# EAGLE design version1 (EAGLE 8.7.1)
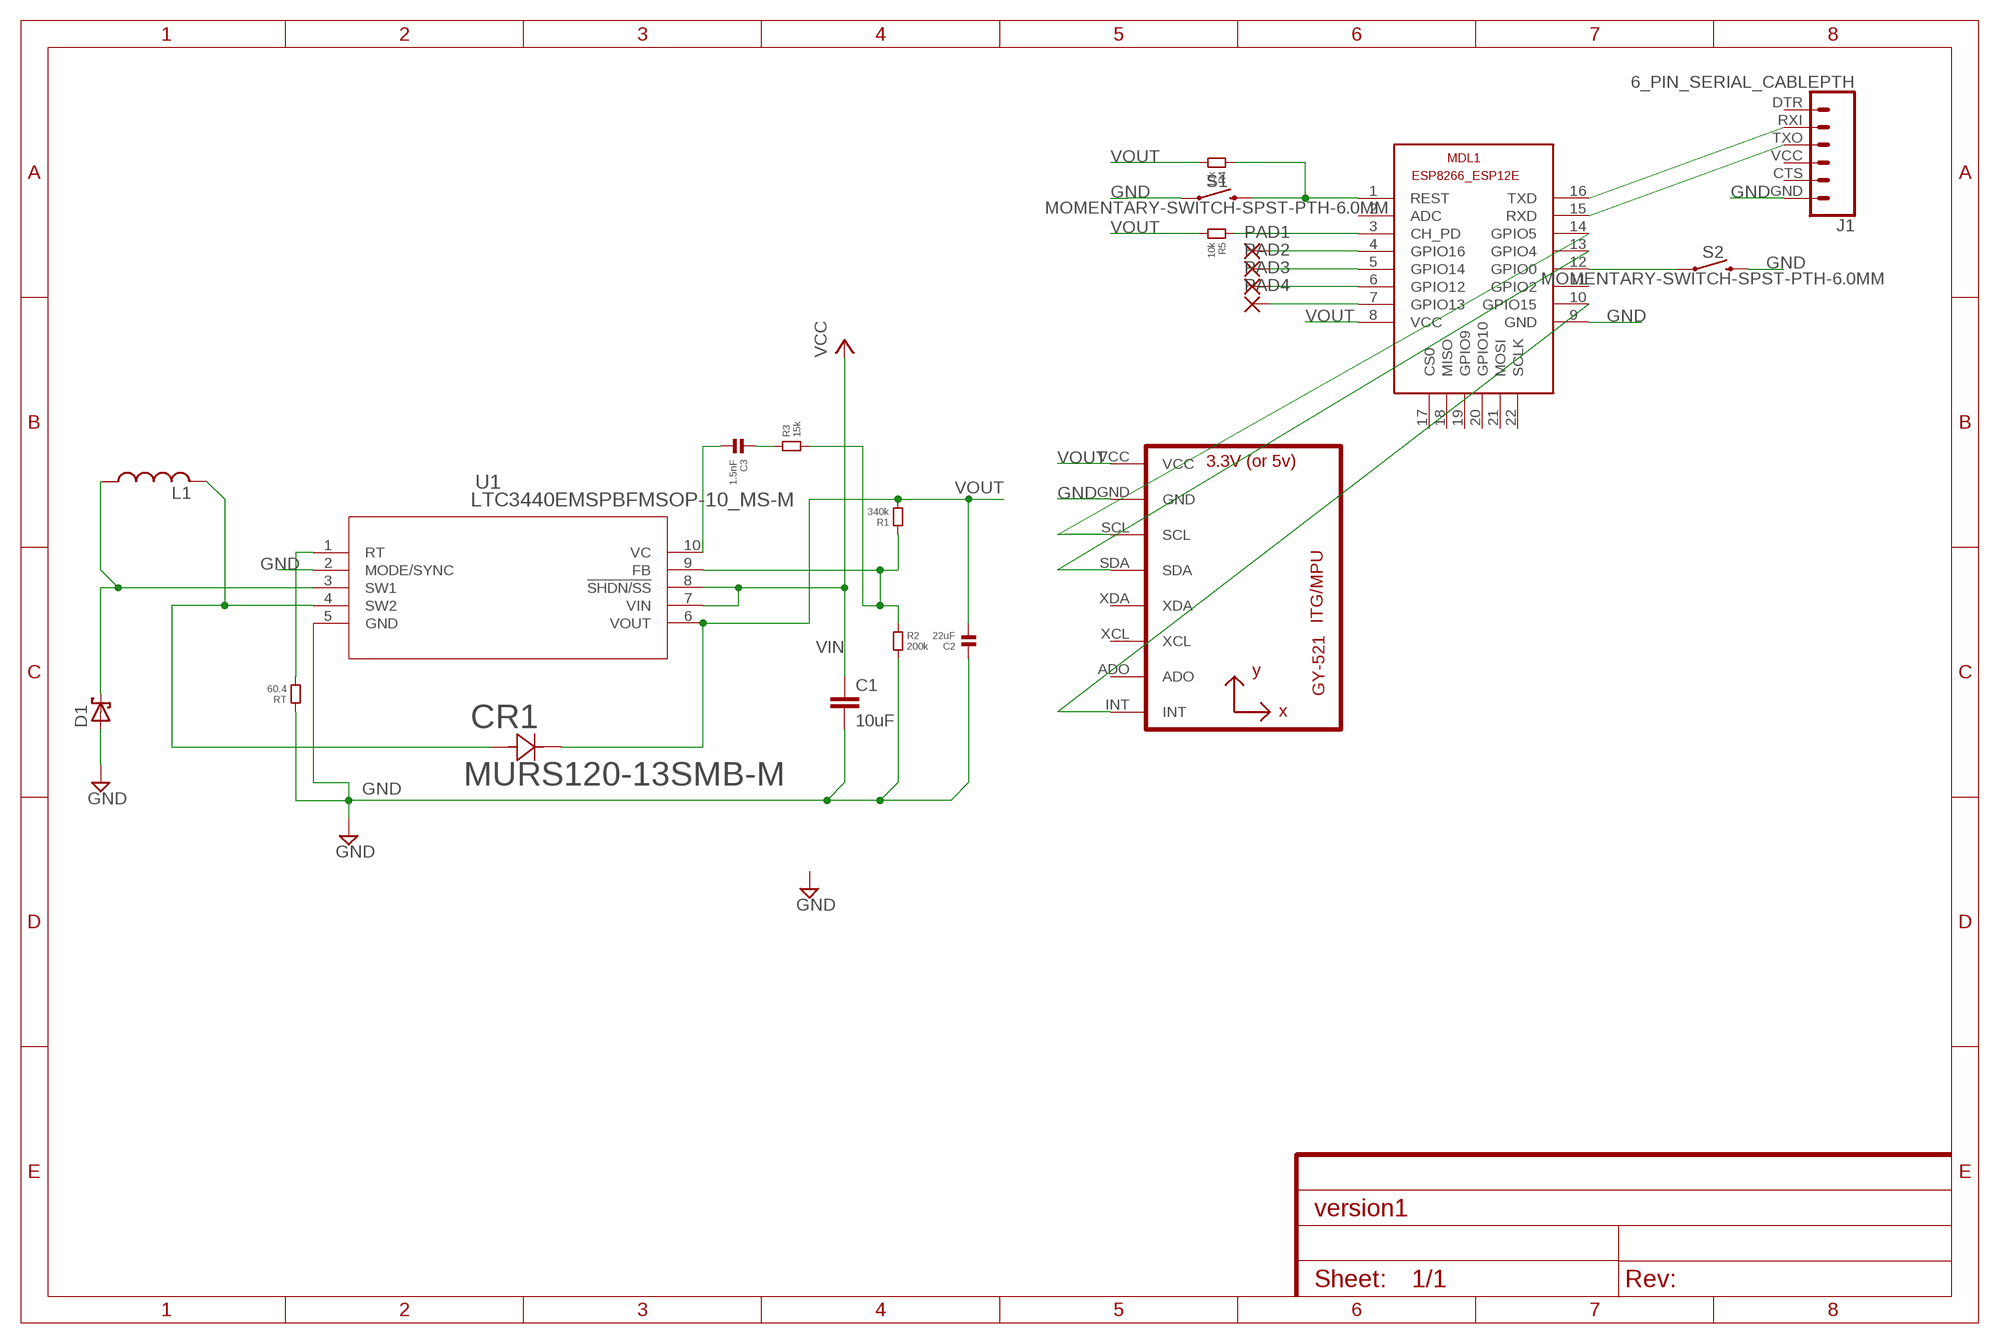
[diagram p0: schematic, sheet 1]

## Parts
C1  10uF  10UF-1206-6.3V-20%  [1206]
C2  22uF  CAPACITOR.1206  [1206]
C3  1.5nF  CAPACITOR.1206  [1206]
CR1  MURS120-13SMB-M  [SMB-M]
D1  SCHOTTKY-DIODEDFLS130L-7  [POWERDI-123]
J1  6_PIN_SERIAL_CABLEPTH  [FTDI_BASIC]
L1  INDUCTOR-SUMIDA-CDRH4D18  [INDUCTOR-SUMIDA-CDRH4D18]
MDL1  ESP8266-12EESP8266-ESP12E  [ESP8266-ESP12E]
PAD1  1,6/0,9  [1,6/0,9]
PAD2  1,6/0,9  [1,6/0,9]
PAD3  1,6/0,9  [1,6/0,9]
PAD4  1,6/0,9  [1,6/0,9]
R1  340k  RESISTOR.1206  [1206]
R2  200k  RESISTOR.1206  [1206]
R3  15k  RESISTOR.1206  [1206]
R4  10k  RESISTOR.1206  [1206]
R5  10k  RESISTOR.1206  [1206]
RT  60.4  RESISTOR.1206  [1206]
S1  MOMENTARY-SWITCH-SPST-PTH-6.0MM  [TACTILE_SWITCH_PTH_6.0MM]
S2  MOMENTARY-SWITCH-SPST-PTH-6.0MM  [TACTILE_SWITCH_PTH_6.0MM]
U1  LTC3440EMSPBFMSOP-10_MS-M  [MSOP-10_MS-M]
U2  GY-521MPU6050  [GY-521]

## Nets
GND: C1.2 C2.1 D1.A J1.GND MDL1.9(GND) R2.2 RT.1 S1.1 S2.3 U1.2(MODE/SYNC) U1.5(GND) U2.GND
N$1: D1.C L1.P$1 U1.3(SW1)
N$2: CR1.2 L1.P$2 U1.4(SW2)
N$3: C3.2 U1.10(VC)
N$4: RT.2 U1.1(RT)
N$5: C3.1 R3.1
N$6: R1.1 R2.1 R3.2 U1.9(FB)
N$7: MDL1.12(GPIO0) S2.1
N$8: MDL1.1(REST) R4.1 S1.3
N$9: J1.RXI MDL1.16(TXD)
N$10: MDL1.3(CH_PD) R5.1
N$11: MDL1.14(GPIO5) U2.SCL
N$12: MDL1.13(GPIO4) U2.SDA
N$13: MDL1.10(GPIO15) U2.INT
N$14: J1.TXO MDL1.15(RXD)
N$16: MDL1.4(GPIO16) PAD1.1(P)
N$17: MDL1.5(GPIO14) PAD2.1(P)
N$18: MDL1.6(GPIO12) PAD3.1(P)
N$19: MDL1.7(GPIO13) PAD4.1(P)
VIN: C1.1 U1.7(VIN) U1.8(!SHDN/SS) ; supply symbol labelled VCC
VOUT: C2.2 CR1.1 MDL1.8(VCC) R1.2 R4.2 R5.2 U1.6(VOUT) U2.VCC
Unconnected: J1.CTS J1.DTR J1.VCC MDL1.2(ADC) MDL1.11(GPIO2) MDL1.17(CS0) MDL1.18(MISO) MDL1.19(GPIO9) MDL1.20(GPIO10) MDL1.21(MOSI) MDL1.22(SCLK) U2.ADO U2.XCL U2.XDA

## Library data of the parts
C1 = SparkFun-Capacitors:10UF: 10.0µF ceramic capacitors A capacitor is a passive two-terminal electrical component used to store electrical energy temporarily in an electric field.; PROD_ID: CAP-10057
C2 C3 = ECE362:CAPACITOR
CR1 = ECE362:MURS120-13; MANUFACTURER_PART_NUMBER: MURS12013; VENDOR: Diodes Inc
D1 = ECE362:SCHOTTKY-DIODE: Schottky Diode; MF: Diodes Inc; MOUSER: 621-DFLS130L; MPN: DFLS130L-7
J1 = SparkFun-Connectors:6_PIN_SERIAL_CABLE: 6-pin header connection for use with the "FTDI BASIC" pinout - CABLE SIDE. Also known as "Arduino Serial Program Header". This is used on a design to provide a 6-pin connection point for serial communication usually from a USB cable (D+/D-) to these headers (RX/TX). It also has the remaining pins necessary for programming in the Arduino evironment (DTR, GND, and sometimes VCC). Note, this device has "CABLE" in the name. It is intended to be used on a design that usually lives on the end of your USB cable and prvides the converter chip (FTDI232 or FTDI231x) to commnicate serial RX/TX. The "sister" device, named "TARGET" is inteneded to be used on a design that contains a target micro-controller that you wish to program. You can populate with some of these: Female Headers <https://www.sparkfun.com/products/115> (PRT-00115) For reference (or to suit your programming needs) check out these designs: SparkFun FTDI Basic Breakout - 5V <https://www.sparkfun.com/products/9716> (DEV-09716) SparkFun FTDI Basic Breakout - 3.3V <https://www.sparkfun.com/products/9873> (DEV-09873) SparkFun FTDI SmartBasic <https://www.sparkfun.com/products/12935> (DEV-12935) SparkFun Beefy 3 - FTDI Basic Breakout <https://www.sparkfun.com/products/13746> (DEV-13746)
L1 = ECE362:INDUCTOR-SUMIDA-CDRH4D18
MDL1 = ESP8266-ESP12E:ESP8266-12E: ESP8266-12E with additional I/O and GPIO04/05 corrected The author cannot warrant that this library is free from error or will meet your specific requirements. Created by PuceBaboon.com. Komagane, Nagano, JAPAN
PAD1-PAD4 = wirepad:1,6/0,9: THROUGH-HOLE PAD
R1-R5 RT = ECE362:RESISTOR
S1 S2 = SparkFun-Switches:MOMENTARY-SWITCH-SPST: Momentary Switch (Pushbutton) - SPST Normally-open (NO) SPST momentary switches (buttons, pushbuttons). Variants PTH-12MM - 12mm square, through-hole Momentary Pushbutton Switch - 12mm Square <https://www.sparkfun.com/products/9190> (COM-09190) PTH-6.0MM, PTH-6.0MM-KIT - 6.0mm square, through-hole Mini Pushbutton Switch <https://www.sparkfun.com/products/97> (COM-00097) KIT package intended for soldering kit's - only one side of pads' copper is exposed. PTH-RIGHT-ANGLE-KIT - Right-angle, through-hole Right Angle Tactile Button <https://www.sparkfun.com/products/10791> - Used on SparkFun BigTime Watch Kit <https://www.sparkfun.com/products/11734> SMD-12MM - 12mm square, surface-mount Tactile Button - SMD (12mm) <https://www.sparkfun.com/products/12993> (COM-12993) Used on SparkFun PicoBoard <https://www.sparkfun.com/products/11888> SMD-4.5MM - 4.5mm Square Trackball Switch Used on SparkFun Blackberry Trackballer Breakout <https://www.sparkfun.com/products/13169> SMD-4.6MMX2.8MM - 4.60mm x 2.80mm, surface mount Used on SparkFun SAMD21 Mini Breakout <https://www.sparkfun.com/products/13664> SMD-5.2MM, SMD-5.2-REDUNDANT - 5.2mm square, surface-mount Mini Pushbutton Switch - SMD <https://www.sparkfun.com/products/8720> (COM-08720) Used on Arduino Pro Mini <https://www.sparkfun.com/products/11114> REDUNDANT package connects both switch circuits together SMD-6.0X3.5MM - 6.0 x 3.5mm, surface mount Momentary Reset Switch SMD <https://www.sparkfun.com/products/8229> (COM-08229) SMD-6.2MM-TALL - 6.2mm square, surface mount Tactile Button - SMD (6mm) <https://www.sparkfun.com/products/12992> Used on SparkFun Digital Sandbox <https://www.sparkfun.com/products/12651> SMD-RIGHT-ANGLE - Right-angle, surface mount Used on SparkFun Block for Intel® Edison - Arduino <https://www.sparkfun.com/products/13036>; PROD_ID: SWCH-08441; SF_SKU: COM-00097
U1 = LTC3440:LTC3440EMSPBF; MANUFACTURER_PART_NUMBER: LTC3440EMS#PBF; VENDOR: Linear Technology
U2 = ECE362:GY-521

## Board
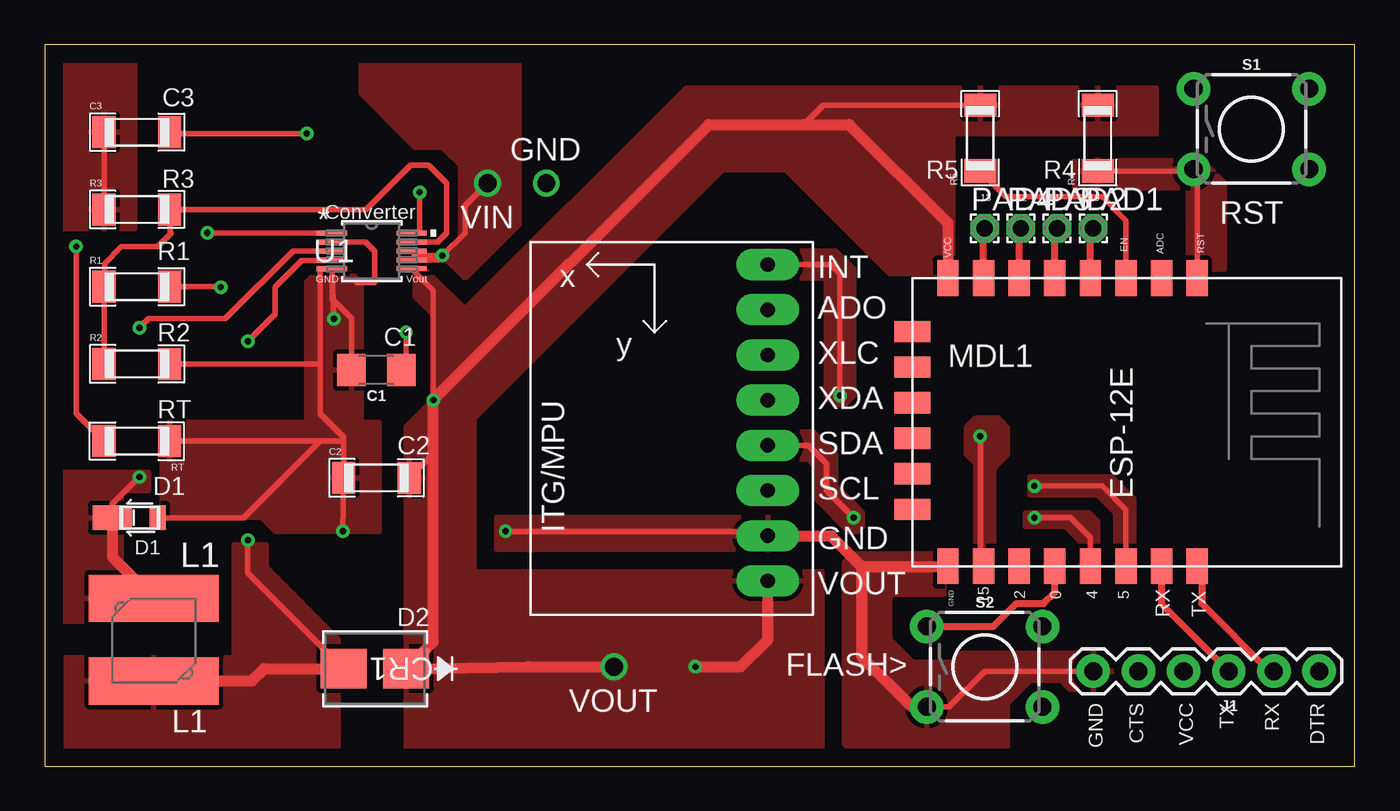
[diagram p1: board, top side]
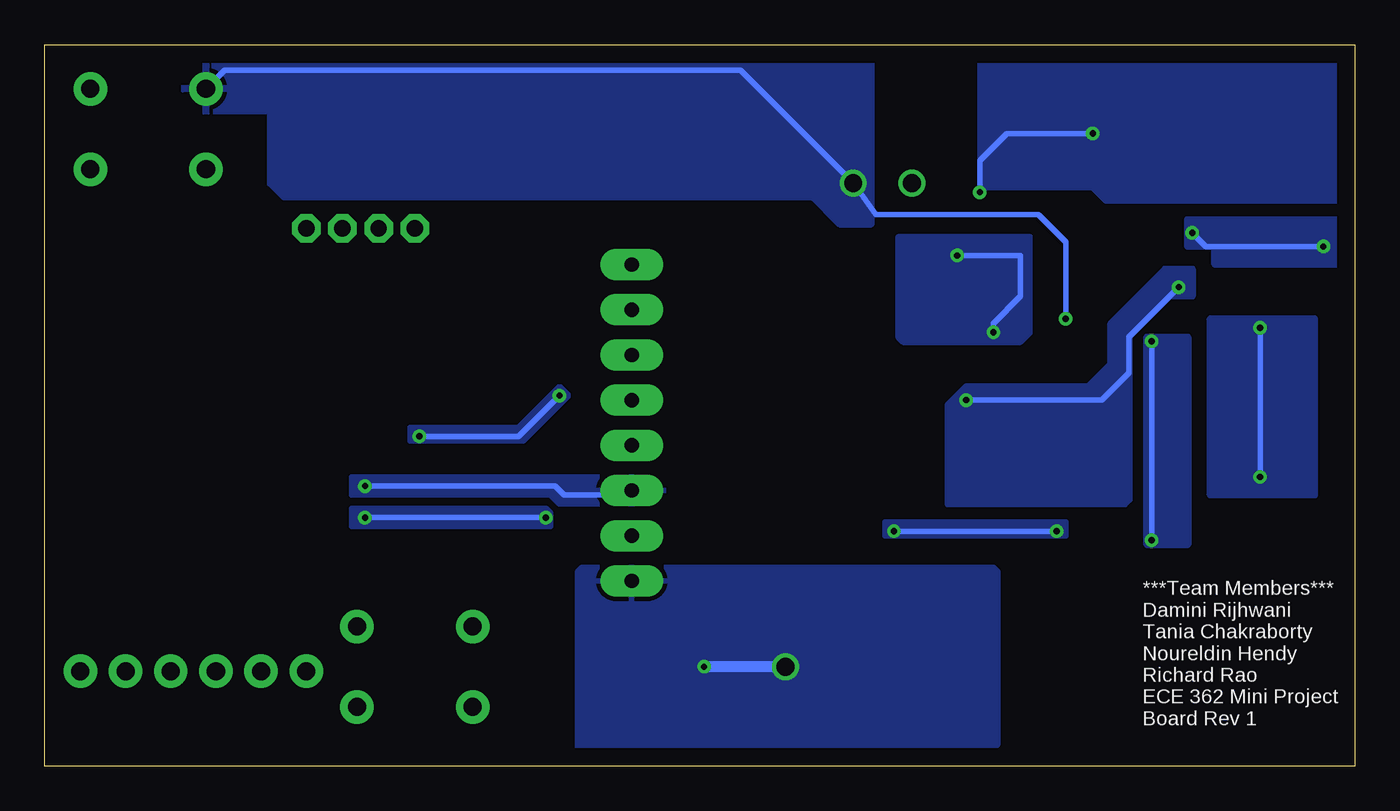
[diagram p2: board, bottom side, seen from below]

Size 73.64 x 40.56 mm. Coordinates in mm from the lower left corner, seen from the top.
Outline: 0,0 73.64,0 73.64,40.56 0,40.56 0,0
Copper layers (1*16): Top 0.035mm / dielectric 1.5mm / Bottom 0.035mm
Design rules "default": minimum track width 6mil, minimum drill 0.35mm, track to track 6mil, track to pad 6mil, pad to pad 6mil, via to via 6mil, smd to smd 6mil, copper to edge 40mil, drill to drill 6mil, minimum pad ring 10mil, minimum via ring 8mil, stop-mask expansion 4mil, vias tented up to drill 0mil, thermal gap 10mil

### Footprints (pad centres in the part's own frame; a part is rotated, then mirrored left to right if it is on the bottom)
1206 = smd 1.6 x 1.8: 1 -1.4,0; 2 1.4,0
1206' = smd 1.3 x 1.8: 1 -1.85,0; 2 1.85,0
SMB-M = smd 2.587 x 2.21: 1 -1.756,0; 2 1.756,0
POWERDI-123 = smd 0.9 x 1.4: A -1.6,0 | smd 2.2 x 1.4: C 0.95,0
FTDI_BASIC = drill 1.016 pad 1.88: CTS 10.16,0; DTR 0,0; GND 12.7,0; RXI 2.54,0; TXO 5.08,0; VCC 7.62,0
INDUCTOR-SUMIDA-CDRH4D18 = smd 7.3 x 2.65: P$1 0,-2.325; P$2 0,2.325
ESP8266-ESP12E = smd 2 x 1.2: 1 -7.62,5.84; 2 -7.62,3.84; 3 -7.62,1.84; 4 -7.62,-0.16; 5 -7.62,-2.16; 6 -7.62,-4.16; 7 -7.62,-6.16; 8 -7.62,-8.16; 9 8.58,-8.16; 10 8.58,-6.16; 11 8.58,-4.16; 12 8.58,-2.16; 13 8.58,-0.16; 14 8.58,1.84; 15 8.58,3.84; 16 8.58,5.84 | smd 1.2 x 2: 17 -4.62,-10.16; 18 -2.62,-10.16; 19 -0.62,-10.16; 20 1.38,-10.16; 21 3.38,-10.16; 22 5.38,-10.16
1,6/0,9 = drill 0.914 pad 1.6 octagon: 1 0,0
TACTILE_SWITCH_PTH_6.0MM = drill 1.016 pad 1.88: 1 -3.251,2.261; 2 3.251,2.261; 3 -3.251,-2.261; 4 3.251,-2.261
MSOP-10_MS-M = smd 1.702 x 0.279: 1 -2.235,1.001; 2 -2.235,0.5; 3 -2.235,0; 4 -2.235,-0.5; 5 -2.235,-1.001; 6 2.235,-1.001; 7 2.235,-0.5; 8 2.235,0; 9 2.235,0.5; 10 2.235,1.001
GY-521 = drill 0.8 pad 1.778 long: ADO -8.89,-6.35; GND -8.89,6.35; INT -8.89,-8.89; SCL -8.89,3.81; SDA -8.89,1.27; VCC -8.89,8.89; XCL -8.89,-3.81; XDA -8.89,-1.27

### Placement (x,y rotation side)
C1  18.65,22.25 180 top
C2  22uF  [1206']  18.65,16.21 0 top
C3  1.5nF  [1206']  5.19,35.63 0 top
CR1  18.57,5.48 180 top
D1  4.76,13.97 180 top
J1  71.63,5.33 180 top
L1  6.14,7.11 180 top
MDL1  58.93,19.81 270 top
PAD1  58.93,30.23 0 top
PAD2  56.9,30.23 0 top
PAD3  54.86,30.23 0 top
PAD4  52.83,30.23 0 top
R1  340k  [1206']  5.19,26.95 0 top
R2  200k  [1206']  5.19,22.61 0 top
R3  15k  [1206']  5.19,31.29 0 top
R4  10k  [1206']  59.18,35.31 90 top
R5  10k  [1206']  52.58,35.31 90 top
RT  60.4  [1206']  5.19,18.27 180 top
S1  67.82,35.81 0 top
S2  52.83,5.59 0 top
U1  18.39,28.96 0 top
U2  31.75,19.3 180 top

### Tracks (layer width: path | path; a pad name or v marks a point on that pad's centre or on a via)
GND  (via drill 0.35, 1)
  Top 0.305: C1.2 17.25,25.17 16.15,26.26 U1.5 | 16.8,18.29 C2.1 v16.76,13.21 | 16.8,18.29 16.8,18.51 15.49,19.81 15.49,22.61 | 15.49,22.61 15.49,27.94 16.14,27.94 U1.5 | R2.2 15.49,22.61 | RT.1 15.49,18.27 | 15.49,18.27 16.78,18.27 16.8,18.29 | D1.A 11.19,13.97 15.49,18.27 | U1.5 v16.26,25.15 | v25.91,13.21 40.13,13.21 U2.GND | S2.3 50.83,3.33 52.83,5.33 J1.GND | U1.2 18.03,29.46 18.54,28.96 18.54,27.18 17.53,27.18
  Top 0.61: 50.8,11.2 MDL1.9 45.92,11.23 | U2.GND 44.2,12.95 45.92,11.23 | 45.92,11.23 45.92,6.15 48.74,3.33 S2.3
  Bottom 0.305: v16.26,25.15 16.26,29.46 17.78,30.99 26.92,30.99 v28.19,32.77 34.54,39.12 63.52,39.12 S1.1 | v16.76,13.21 v25.91,13.21
  pour Top: 15.24,27.69 14.73,27.18 14.73,15.75 17.53,15.75 17.78,16 17.78,27.18 17.27,27.69
  pour Top: 6.6,13.97 6.6,19.3 18.29,19.3 18.8,19.3 18.8,13.21 12.95,13.21 12.19,13.97
  pour Top: 50.55,11.94 45.47,11.94 44.96,11.43 44.96,1.27 45.47,0.76 51.82,0.76 52.58,1.52 52.58,4.32 51.31,5.59 51.05,5.84 48.77,5.84 47.5,7.11 47.5,9.65 50.55,9.65 50.55,11.68
  pour Top: 51.05,5.84 51.56,6.35 52.83,6.35 59.18,6.35 59.44,6.35 59.94,5.84 59.94,4.83 59.44,4.32 57.66,4.32 57.15,4.83 55.37,4.83 54.61,4.06 54.1,3.56 54.1,1.02 50.8,1.02 50.8,2.79 51.31,3.3 51.31,5.59
  pour Top: 41.15,13.97 25.4,13.97 25.4,12.19 41.15,12.19
  pour Bottom: 16.26,13.72 26.42,13.72 26.42,12.95 16.26,12.95
  pour Bottom: 65.79,38.61 65.79,37.59 65.02,36.83 61.21,36.83 60.96,37.08 60.96,32.77 60.2,32 30.48,32 28.96,30.48 27.18,30.48 27.18,39.88 27.43,40.13 64.26,40.13
N$1  (via drill 0.35)
  Top 0.305: D1.C 3.81,14.73 4.83,15.75 v5.33,16.26 | v5.33,24.64 5.84,25.15 10.16,25.15 13.97,28.96 U1.3
  Top 0.61: D1.C 3.81,11.77 L1.P$1
  Bottom 0.305: v5.33,16.26 5.33,16.76 v5.33,24.64
  pour Top: 5.84,16.51 0.25,16.51 0.25,8.13 4.32,8.13 4.32,15.49 5.84,15.49
  pour Bottom: 8.13,25.15 2.29,25.15 2.29,24.89 2.29,15.24 7.62,15.24 8.13,15.24
N$2  (via drill 0.35)
  Top 0.305: CR1.2 11.43,10.87 v11.43,12.7 | v11.43,23.88 12.95,25.4 12.95,26.92 14.44,28.41 16.11,28.41 U1.4
  Top 0.61: L1.P$2 11.64,4.79 12.34,5.48 CR1.2
  Bottom 0.305: v11.43,12.7 v11.43,23.88
  pour Top: 1.27,6.1 10.67,6.1 10.67,12.45 12.45,12.45 12.45,11.43 12.45,11.18 16.51,7.11 16.51,0.25 0.76,0.25 0.76,5.84 1.02,6.1
  pour Bottom: 11.68,24.13 10.67,24.13 9.4,24.13 9.4,12.7 9.4,12.45 11.68,12.45
N$3  (via drill 0.35)
  Top 0.305: C3.2 7.12,35.56 v14.73,35.56 | v21.08,32.26 21.08,29.97 21.07,29.96 U1.10
  Bottom 0.305: v14.73,35.56 19.56,35.56 21.08,34.04 v21.08,32.26
  pour Bottom: 21.08,32.26 21.08,40.39 0.25,40.39 0,40.13 0,32 0.25,31.75 13.97,31.75 14.73,32.51 20.83,32.51
N$4  (via drill 0.35)
  Top 0.305: RT.2 1.78,19.84 v1.78,29.21 | v9.14,29.97 16.14,29.97 U1.1
  Bottom 0.305: v1.78,29.21 8.38,29.21 v9.14,29.97
  pour Bottom: 9.4,30.73 1.27,30.73 1.02,30.73 1.02,28.19 7.87,28.19 7.87,29.21 9.4,29.21
N$5
  Top 0.305: C3.1 R3.1
  pour Top: 0.51,39.88 5.08,39.88 5.08,30.23 0.51,30.23
N$6
  Top 0.305: R2.1 R1.1 3.37,28.26 4.32,29.21 6.35,29.21 7.11,29.97 7.07,30.01 R3.2 18.09,31.29 20.57,33.78 21.59,33.78 22.61,32.77 22.61,29.97 22.09,29.46 U1.9
N$7
  Top 0.406: S2.1 53.31,7.85 54.61,9.14 56.13,9.14 56.77,9.78 MDL1.12
N$8
  Top 0.305: R4.1 64.47,33.46 S1.3 64.77,33.35 MDL1.1
  pour Top: 57.91,34.04 65.02,34.04 66.04,33.02 66.29,32.77 66.29,27.94 64.26,27.94 64.26,32.26 64.01,32.51 57.91,32.51
N$9
  Top 0.305: MDL1.16 65.02,10.98 | 68.83,5.33 J1.RXI
  Top 0.406: 65.02,10.98 65.02,9.14 68.83,5.33
N$10
  Top 0.305: R5.1 54.03,32 59.44,32 60.77,30.67 MDL1.3
N$11  (via drill 0.35)
  Top 0.305: MDL1.14 60.77,14.42 59.44,15.75 v55.63,15.75
  Bottom 0.305: v55.63,15.75 44.96,15.75 44.45,15.24 40.89,15.24 U2.SCL
  pour Top: 61.21,11.43 61.21,14.99 59.94,16.26 55.37,16.26 55.37,15.24 59.18,15.24 60.2,14.22 60.2,11.43
  pour Bottom: 56.39,16.26 56.39,15.24 45.21,15.24 44.7,14.73 38.86,14.73 38.86,16.26
N$12  (via drill 0.35)
  Top 0.305: MDL1.13 58.77,12.86 57.66,13.97 v55.63,13.97 | v45.47,13.97 43.94,15.49 43.94,17.02 42.93,18.03 U2.SDA
  Bottom 0.305: v55.63,13.97 v45.47,13.97
  pour Top: 55.63,14.22 58.67,14.22 59.18,13.72 59.18,11.43 58.17,11.43 58.17,12.7 57.4,13.46 55.63,13.46 55.12,13.46 55.12,14.22
  pour Bottom: 56.39,14.48 56.39,13.46 45.21,13.46 45.21,14.22 45.47,14.48
  pour Top: 45.97,14.22 44.45,15.75 44.45,17.53 43.18,18.8 41.15,18.8 41.15,17.27 42.93,17.27 43.43,16.76 43.43,14.99 45.21,13.21 45.72,13.21 45.97,13.46
N$13  (via drill 0.35)
  Top 0.305: U2.INT 44.2,28.19 44.7,27.69 v44.7,20.83 | v52.58,18.54 52.58,11.42 MDL1.10
  Bottom 0.305: v44.7,20.83 46.99,18.54 v52.58,18.54
  pour Bottom: 53.09,19.05 53.09,18.29 46.74,18.29 44.2,20.83 44.7,21.34 46.99,19.05
  pour Top: 40.64,28.96 44.45,28.96 45.47,27.94 45.47,20.83 45.21,20.57 44.96,20.32 44.45,20.32 43.94,20.83 43.94,27.43 39.12,27.43 39.12,28.96
  pour Top: 52.32,11.68 52.32,17.02 51.82,17.53 51.82,19.05 52.32,19.56 53.59,19.56 54.1,19.05 54.1,17.53 53.34,16.76 53.34,11.68
N$14
  Top 0.406: MDL1.15 62.77,9.11 J1.TXO
N$16
  Top 0.406: MDL1.4 58.77,30.07 PAD1.1
N$17
  Top 0.406: MDL1.5 56.77,30.1 PAD2.1
N$18
  Top 0.406: MDL1.6 54.77,30.13 PAD3.1
N$19
  Top 0.406: MDL1.7 52.77,30.16 PAD4.1
VIN  (via drill 0.35, 1)
  Top 0.305: U1.8 20.88,28.7 v22.35,28.7 | v22.35,28.7 23.62,29.97 23.62,31.5 v24.89,32.77 | v22.35,28.7 22.11,28.46 U1.7 | v20.32,24.38 20.32,22.52 C1.1
  Bottom 0.305: v22.35,28.7 18.8,28.7 18.8,26.42 20.32,24.89 v20.32,24.38
  pour Top: 22.35,28.7 23.62,27.43 26.67,30.48 26.67,39.88 17.78,39.88 17.78,37.85 20.07,35.56 20.83,34.8 22.35,34.8 23.37,33.78 23.37,30.23 23.37,29.72
  pour Bottom: 25.65,29.72 25.65,24.13 25.4,23.88 18.8,23.88 18.29,24.38 18.29,29.72
VOUT  (via drill 0.35, 1)
  Top 0.305: C2.2 21.84,17.55 v21.84,20.57 21.84,26.74 U1.6 | R1.2 9.88,26.95 v9.91,26.92 | R5.2 43.76,37.16 42.67,36.07
  Top 0.61: v32,5.59 27.18,5.59 CR1.1 21.84,7 v21.84,20.57 37.34,36.07 42.67,36.07 45.21,36.07 50.77,30.51 MDL1.8 | v36.58,5.59 39.12,5.59 40.64,7.11 U2.VCC
  Bottom 0.305: v9.91,26.92 12.7,24.13 12.7,22.1 14.22,20.57 v21.84,20.57
  Bottom 0.61: v32,5.59 v36.58,5.59
  pour Top: 21.34,27.94 24.13,25.15 24.13,5.08 20.32,5.08 20.32,19.05 21.84,20.57 21.84,25.4 20.83,26.42 20.83,27.94
  pour Top: 42.67,36.07 44.7,38.1 62.48,38.1 62.48,35.56 42.93,35.56 42.67,35.81
  pour Top: 43.69,10.92 20.32,10.92 20.32,0.76 20.57,0.51 43.69,0.51
  pour Top: 23.11,25.15 36.07,38.1 50.8,38.1 51.05,38.1 51.05,27.69 47.5,27.69 41.66,33.53 38.1,33.53 24.13,19.56 24.13,24.13
  pour Bottom: 43.69,10.92 43.69,1.02 20.32,1.02 20.07,1.27 20.07,10.92 20.32,11.18 43.43,11.18
  pour Bottom: 22.35,20.83 21.84,21.34 14.99,21.34 13.72,22.61 13.72,24.89 10.67,27.94 9.14,27.94 9.14,26.42 10.41,26.42 12.7,24.13 12.7,14.99 12.95,14.73 22.86,14.73 22.86,20.32

### Text on the board
tPlace: C3 | GND | R3 | R5 | R4 | 13 | 12 | 14 | 16 | Converter | VIN | VCC | EN | ADC | RST | RST | R1 | GND | Vout | INT | ADO | R2 | C1 | XLC | RT | XDA | C2 | SDA | D1 | SCL | GND | L1 | VOUT | GND | 15 | 2 | 0 | 4 | 5 | D2 | RX | TX | FLASH> | GND | CTS | VCC | TX | RX | DTR | VOUT
bPlace: ***Team Members*** / Damini Rijhwani / Tania Chakraborty / Noureldin Hendy / Richard Rao / ECE 362 Mini Project / Board Rev 1